# EAGLE schematic comms_sys_schematic_V1 (EAGLE 9.5.2)
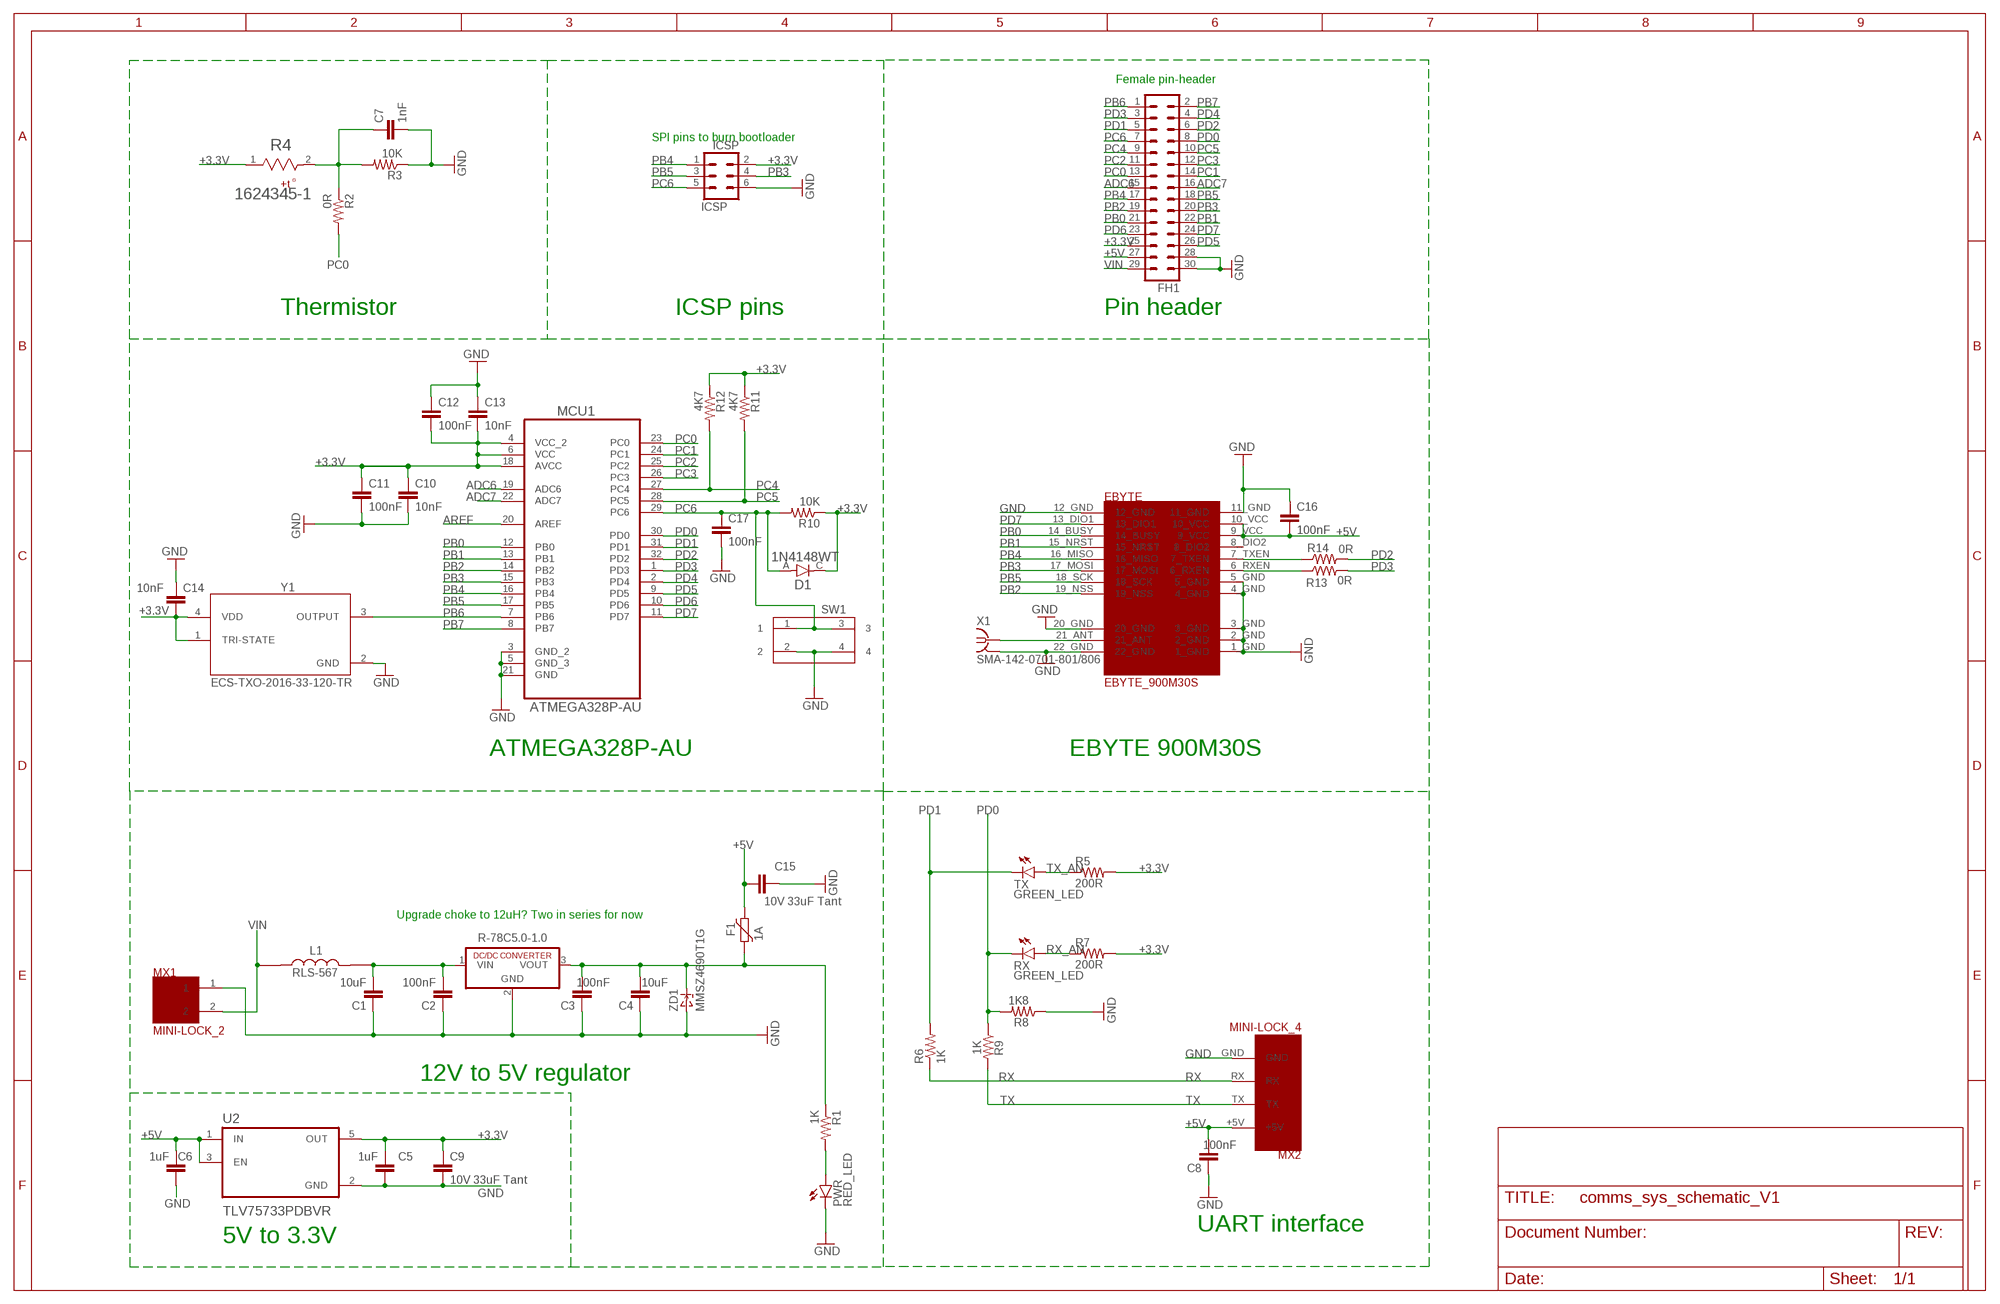
[diagram p0: schematic, sheet 1]

## Parts
C1  10uF  C-EUC0805  [C0805]
C2  100nF  C-EUC0805  [C0805]
C3  100nF  C-EUC0805  [C0805]
C4  10uF  C-EUC0805  [C0805]
C5  1uF  C-EUC0805  [C0805]
C6  1uF  C-EUC0805  [C0805]
C7  1nF  C-EUC0805  [C0805]
C8  100nF  C-EUC0805  [C0805]
C9  10V 33uF Tant  C-EUC1206  [C1206]
C10  10nF  C-EUC0805  [C0805]
C11  100nF  C-EUC0805  [C0805]
C12  100nF  C-EUC0805  [C0805]
C13  10nF  C-EUC0805  [C0805]
C14  10nF  C-EUC0805  [C0805]
C15  10V 33uF Tant  C-EUC1206  [C1206]
C16  100nF  C-EUC0805  [C0805]
C17  100nF  C-EUC0805  [C0805]
D1  1N4148WT  [SODFL1608X70N]
EBYTE  EBYTE_900M30S  EBYTE_SX1262_900M30S  [EBYTE_SX1262_900M30S_FOOTPRINT]
F1  1A  FUSE_PTC-0805  [PTC0805]
FH1  MA15-2  [MA15-2]
ICSP  ICSP  MA03-2  [MA03-2]
L1  RLS-567  [IND_RLS-567]
MCU1  ATMEGA328P-AU  [QFP80P900X900X120-32N]
MX1  MINI-LOCK_2  [MINI-LOCK_2]
MX2  MINI-LOCK_4  [MINI-LOCK_4]
PWR  RED_LED  LEDCHIP-LED0805  [CHIP-LED0805]
R1  1K  R-US_R0805  [R0805]
R2  0R  R-US_R0805  [R0805]
R3  10K  R-US_R0805  [R0805]
R4  1624345-1  [THRMC2012X50N]
R5  200R  R-US_R0805  [R0805]
R6  1K  R-US_R0805  [R0805]
R7  200R  R-US_R0805  [R0805]
R8  1K8  R-US_R0805  [R0805]
R9  1K  R-US_R0805  [R0805]
R10  10K  R-US_R0805  [R0805]
R11  4K7  R-US_R0805  [R0805]
R12  4K7  R-US_R0805  [R0805]
R13  0R  R-US_R0805  [R0805]
R14  0R  R-US_R0805  [R0805]
RX  GREEN_LED  LEDCHIP-LED0805  [CHIP-LED0805]
SW1  430152043826  [430152043826]
TX  GREEN_LED  LEDCHIP-LED0805  [CHIP-LED0805]
U1  R-78C5.0-1.0  [SIP3]
U2  TLV75733PDBVR  [SOT95P280X145-5N]
X1  SMA-142-0701-801/806  [J502-ND-142-0701-801/806]
Y1  ECS-TXO-2016-33-120-TR  [OSC_ECS-TXO-2016-33-120-TR]
ZD1  MMSZ4690T1G  ZENERSOD-123  [SOD-123]

## Nets
$N77: C7.1 R2.1 R3.2 R4.2
+3.3V: C5.2 C9.1 C10.1 C11.1 C12.2 C13.2 C14.2 D1.C FH1.25 ICSP.2 MCU1.4(VCC_2) MCU1.6(VCC) MCU1.18(AVCC) R4.1 R5.2 R7.2 R10.1 R11.1 R12.1 U2.5(OUT) Y1.1(TRI-STATE) Y1.4(VDD)
+5V: C6.2 C8.2 C15.1 C16.2 EBYTE.9_VCC EBYTE.10_VCC F1.2 FH1.27 MX2.+5V U2.1(IN) U2.3(EN)
ADC6: FH1.15 MCU1.19(ADC6)
ADC7: FH1.16 MCU1.22(ADC7)
AREF: MCU1.20(AREF)
GND: C1.1 C2.1 C3.1 C4.1 C5.1 C6.1 C7.2 C8.1 C9.2 C10.2 C11.2 C12.1 C13.1 C14.1 C15.2 C16.1 C17.2 EBYTE.1_GND EBYTE.2_GND EBYTE.3_GND EBYTE.4_GND EBYTE.5_GND EBYTE.11_GND EBYTE.12_GND EBYTE.20_GND EBYTE.22_GND FH1.28 FH1.30 ICSP.6 MCU1.3(GND_2) MCU1.5(GND_3) MCU1.21(GND) MX1.1 MX2.GND PWR.C R3.1 R8.1 SW1.2 SW1.4 U1.2(GND) U2.2(GND) X1.G@1 X1.G@2 X1.G@3 X1.G@4 Y1.2(GND) ZD1.A
N$1: C3.2 C4.2 F1.1 R1.1 U1.3(VOUT) ZD1.C
N$4: PWR.A R1.2
N$6: EBYTE.7_TXEN R14.1
N$7: EBYTE.6_RXEN R13.1
N$8: EBYTE.21_ANT X1.1
N$27: C1.2 C2.2 L1.2 U1.1(VIN)
PB0: EBYTE.14_BUSY FH1.21 MCU1.12(PB0)
PB1: EBYTE.15_NRST FH1.22 MCU1.13(PB1)
PB2: EBYTE.19_NSS FH1.19 MCU1.14(PB2)
PB3: EBYTE.17_MOSI FH1.20 ICSP.4 MCU1.15(PB3)
PB4: EBYTE.16_MISO FH1.17 ICSP.1 MCU1.16(PB4)
PB5 [SCK]: EBYTE.18_SCK FH1.18 ICSP.3 MCU1.17(PB5)
PB6: FH1.1 MCU1.7(PB6) Y1.3(OUTPUT)
PB7: FH1.2 MCU1.8(PB7)
PC0: FH1.13 MCU1.23(PC0) R2.2
PC1: FH1.14 MCU1.24(PC1)
PC2: FH1.11 MCU1.25(PC2)
PC3: FH1.12 MCU1.26(PC3)
PC4: FH1.9 MCU1.27(PC4) R12.2
PC5: FH1.10 MCU1.28(PC5) R11.2
PC6: C17.1 D1.A FH1.7 ICSP.5 MCU1.29(PC6) R10.2 SW1.1 SW1.3
PD0: FH1.8 MCU1.30(PD0) R8.2 R9.1 RX.C
PD1: FH1.5 MCU1.31(PD1) R6.2 TX.C
PD2: FH1.6 MCU1.32(PD2) R14.2
PD3: FH1.3 MCU1.1(PD3) R13.2
PD4: FH1.4 MCU1.2(PD4)
PD5: FH1.26 MCU1.9(PD5)
PD6: FH1.23 MCU1.10(PD6)
PD7: EBYTE.13_DIO1 FH1.24 MCU1.11(PD7)
RX: MX2.RX R6.1
RX_AN: R7.1 RX.A
TX: MX2.TX R9.2
TX_AN: R5.1 TX.A
VIN: FH1.29 L1.1 MX1.2
Unconnected: EBYTE.8_DIO2

## Notes on the sheet
- Female pin-header
- SPI pins to burn bootloader
- Thermistor | ICSP pins | Pin header
- ATMEGA328P-AU | EBYTE 900M30S
- Upgrade choke to 12uH? Two in series for now
- 12V to 5V regulator
- UART interface
- 5V to 3.3V

## Library data of the parts
C1-C17 = rcl:C-EU: CAPACITOR, European symbol; SPICEPREFIX: C
D1 = 1N4148WT:1N4148WT: Diode Switching 100V 0.125A 2-Pin SOD-523; DESCRIPTION: Diode Standard 75V 200mA Surface Mount SOD-523F; DIGI-KEY_PART_NUMBER: 1N4148WTCT-ND; MF: ON Semiconductor; MP: 1N4148WT; PACKAGE: SOD-523-2 ON Semiconductor; PURCHASE-URL: https://pricing.snapeda.com/search/part/1N4148WT/?ref=eda
EBYTE = cust_parts:EBYTE_SX1262_900M30S
F1 = dp_devices.v6:FUSE_PTC: Resettable PTC
FH1 = con-lstb:MA15-2: PIN HEADER
ICSP = con-lstb:MA03-2: PIN HEADER; OC_FARNELL: unknown; OC_NEWARK: unknown
L1 = RLS-567:RLS-567: Line Inductors for RECOM Power Supply; AVAILABILITY: Unavailable; DESCRIPTION: Line Inductors for RECOM Power Supply; DIGIKEY-PURCHASE-URL: https://snapeda.com/shop?store=DigiKey&id=3641543; MF: Recom Power; MP: RLS-567; PACKAGE: 1812 Recom Power; PRICE: None
MCU1 = Atmel_By_element14_Batch_1-00:ATMEGA328P-AU: 8-bit Microcontroller with In-System Programmable Flash; MPN: ATMEGA328P-AU; OC_FARNELL: 1715486; OC_NEWARK: 14R4631; PACKAGE: TQFP-32; SUPPLIER: Atmel
MX1 = cust_parts:MINI-LOCK_2
MX2 = cust_parts:MINI-LOCK_4
PWR RX TX = led:LED: LED OSRAM: - CHIPLED LG R971, LG N971, LY N971, LG Q971, LY Q971, LO R971, LY R971 LH N974, LH R974 LS Q976, LO Q976, LY Q976 LO Q996 - Hyper CHIPLED LW Q18S LB Q993, LB Q99A, LB R99A - SideLED LS A670, LO A670, LY A670, LG A670, LP A670 LB A673, LV A673, LT A673, LW A673 LH A674 LY A675 LS A676, LA A676, LO A676, LY A676, LW A676 LS A679, LY A679, LG A679 - Hyper Micro SIDELED® LS Y876, LA Y876, LO Y876, LY Y876 LT Y87S - SmartLED LW L88C, LW L88S LB L89C, LB L89S, LG L890 LS L89K, LO L89K, LY L89K LS L896, LA L896, LO L896, LY L896 - TOPLED LS T670, LO T670, LY T670, LG T670, LP T670 LSG T670, LSP T670, LSY T670, LOP T670, LYG T670 LG T671, LOG T671, LSG T671 LB T673, LV T673, LT T673, LW T673 LH T674 LS T676, LA T676, LO T676, LY T676, LB T676, LH T676, LSB T676, LW T676 LB T67C, LV T67C, LT T67C, LS T67K, LO T67K, LY T67K, LW E67C LS E67B, LA E67B, LO E67B, LY E67B, LB E67C, LV E67C, LT E67C LW T67C LS T679, LY T679, LG T679 LS T770, LO T770, LY T770, LG T770, LP T770 LB T773, LV T773, LT T773, LW T773 LH T774 LS E675, LA E675, LY E675, LS T675 LS T776, LA T776, LO T776, LY T776, LB T776 LHGB T686 LT T68C, LB T68C - Hyper Mini TOPLED® LB M676 - Mini TOPLED Santana® LG M470 LS M47K, LO M47K, LY M47K Source: http://www.osram.convergy.de LUXEON: - LUMILED® LXK2-PW12-R00, LXK2-PW12-S00, LXK2-PW14-U00, LXK2-PW14-V00 LXK2-PM12-R00, LXK2-PM12-S00, LXK2-PM14-U00 LXK2-PE12-Q00, LXK2-PE12-R00, LXK2-PE12-S00, LXK2-PE14-T00, LXK2-PE14-U00 LXK2-PB12-K00, LXK2-PB12-L00, LXK2-PB12-M00, LXK2-PB14-N00, LXK2-PB14-P00, LXK2-PB14-Q00 LXK2-PR12-L00, LXK2-PR12-M00, LXK2-PR14-Q00, LXK2-PR14-R00 LXK2-PD12-Q00, LXK2-PD12-R00, LXK2-PD12-S00 LXK2-PH12-R00, LXK2-PH12-S00 LXK2-PL12-P00, LXK2-PL12-Q00, LXK2-PL12-R00 Source: www.luxeon.com KINGBRIGHT: KA-3528ASYC Source: www.kingbright.com
R1-R3 R5-R14 = rcl:R-US_: RESISTOR, American symbol; SPICEPREFIX: R
R4 = 1624345-1:1624345-1: NTC0805 5% 10K; COMMENT: 1624345-1; DESCRIPTION: Thermistor NTC 10K Ohm 5% 2-Pin 0805 Surface Mount Solder Pad 4100K T/R; DIGI-KEY_PART_NUMBER: A106104CT-ND; MF: TE Connectivity; MP: NTC0805J10K; PACKAGE: 0805 TE Connectivity; PURCHASE-URL: https://pricing.snapeda.com/search/part/NTC0805J10K/?ref=eda
SW1 = Wurth_Elektronik_Electromechanic_Switch_rev16c:430152043826: 6x6 mm SMD WS-TASV <http://katalog.we-online.de/media/images/v2/Family_WS-TASV_6x6mm_SMD_Tact_Switch_4301820xx8xx.jpg> Details see: http://katalog.we-online.de/en/em/TASV_6X6_SMD 2015 (C) Würth Elektronik
U1 = dc-dc-converter:R-78C*-1.0: INNOLINE DC/DC-Converter 1.0 AMP SIP3 Single Output Source: Data sheet <http://www.mikrocontroller.net/attachment/150645/157764-da-01-en-DC_DC_WANDLER_R_78C5_0_1_0.pdf>
U2 = TLV75733PDBVR:TLV75733PDBVR; DESCRIPTION: 1-A, low-IQ, high-accuracy, low-dropout voltage regulator with enable 5-SOT-23 -40 to 125; DIGI-KEY_PART_NUMBER: 296-50414-1-ND; MF: Texas Instruments; MP: TLV75733PDBVR; PACKAGE: SOT-23-5 Texas Instruments; PURCHASE-URL: https://pricing.snapeda.com/search/part/TLV75733PDBVR/?ref=eda
X1 = con-coax:SMA-: SMA 50 Ohm End Launch Jack Receptacle - Round Contact Johnson Components Source: www.johnsoncomponents.com .. J502-ND.pdf; MF: JOHNSON COMPONENTS; MPN: 142-0701-801; OC_FARNELL: 1608592; OC_NEWARK: 90F2624
Y1 = ECS-TXO-2016-33-120-TR:ECS-TXO-2016-33-120-TR; DESCRIPTION: Oscillator TCXO 12MHz ±2ppm (Tol) ±2.5ppm (Stability) 15pF HCMOS 55% 3.3V 4-Pin Mini-CSMD T/R; DIGI-KEY_PART_NUMBER: XC3160CT-ND; MF: ECS Inc.; MP: ECS-TXO-2016-33-120-TR; PACKAGE: None; PURCHASE-URL: https://pricing.snapeda.com/search/part/ECS-TXO-2016-33-120-TR/?ref=eda
ZD1 = dp_devices.v6:ZENER: Zener Diode SOD-323